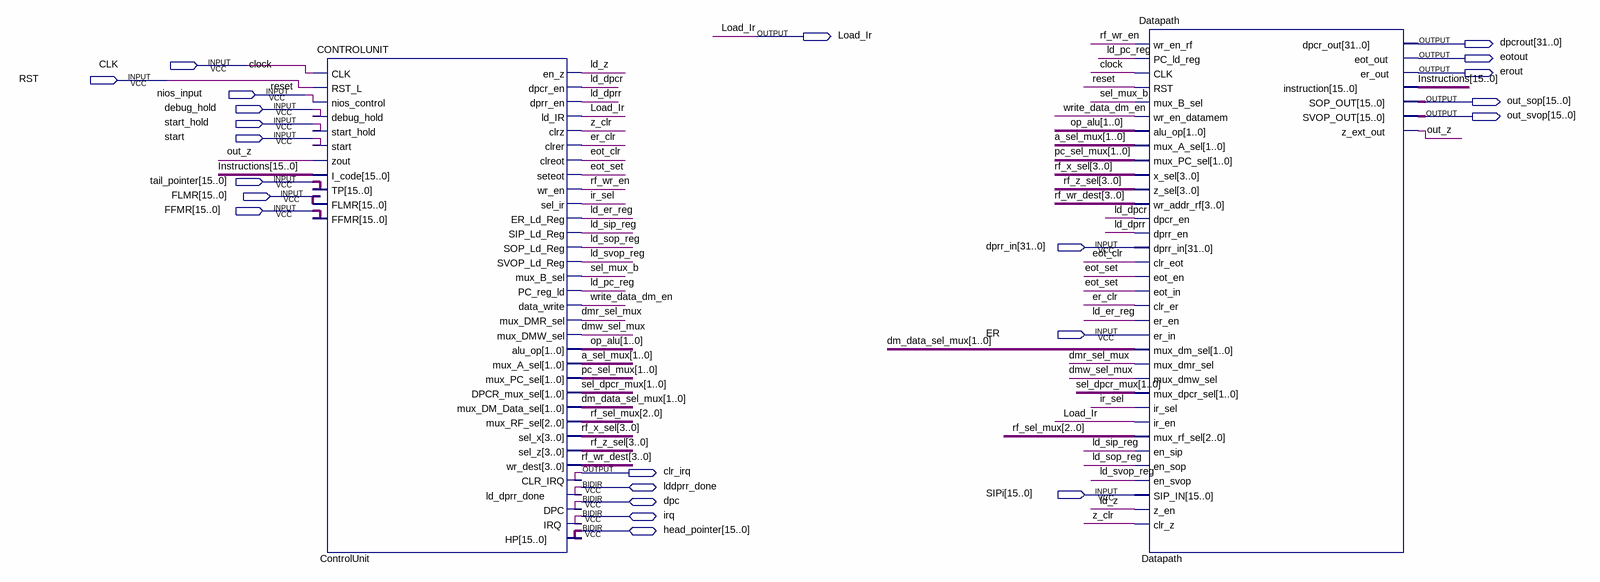
[diagram p0: schematic sheet]
// Quartus schematic Processor.bdf as structural Verilog: 2 symbols, 23 pins
module Processor (
  input  CLK,
  input  RST,
  input  nios_input,
  input  debug_hold,
  input  start_hold,
  input  start,
  input  [15:0] tail_pointer,
  input  [15:0] FLMR,
  input  [15:0] FFMR,
  input  [31:0] dprr_in,
  input  ER,
  input  [15:0] SIPi,
  inout  lddprr_done,
  inout  dpc,
  inout  irq,
  inout  [15:0] head_pointer,
  output Load_Ir,
  output [31:0] dpcrout,
  output eotout,
  output erout,
  output [15:0] out_sop,
  output [15:0] out_svop,
  output clr_irq
);

  wire dmr_sel_mux, dmw_sel_mux, eot_clr, eot_set, er_clr, ir_sel, ld_dpcr, ld_dprr, ld_er_reg, ld_pc_reg,
       ld_sip_reg, ld_sop_reg, ld_svop_reg, ld_z, out_z, rf_wr_en, sel_mux_b, write_data_dm_en, z_clr;
  wire [1:0] a_sel_mux, dm_data_sel_mux, op_alu, pc_sel_mux, sel_dpcr_mux;
  wire [2:0] rf_sel_mux;
  wire [3:0] rf_wr_dest, rf_x_sel, rf_z_sel;
  wire [15:0] Instructions;

  CONTROLUNIT ControlUnit (
    .CLK(CLK), .RST_L(RST), .nios_control(nios_input), .debug_hold(debug_hold), .start_hold(start_hold),
    .start(start), .zout(out_z), .I_code(Instructions), .TP(tail_pointer), .FLMR(FLMR), .FFMR(FFMR),
    .en_z(ld_z), .dpcr_en(ld_dpcr), .dprr_en(ld_dprr), .ld_IR(Load_Ir), .clrz(z_clr), .clrer(er_clr),
    .clreot(eot_clr), .seteot(eot_set), .wr_en(rf_wr_en), .sel_ir(ir_sel), .ER_Ld_Reg(ld_er_reg),
    .SIP_Ld_Reg(ld_sip_reg), .SOP_Ld_Reg(ld_sop_reg), .SVOP_Ld_Reg(ld_svop_reg), .mux_B_sel(sel_mux_b),
    .PC_reg_ld(ld_pc_reg), .data_write(write_data_dm_en), .mux_DMR_sel(dmr_sel_mux),
    .mux_DMW_sel(dmw_sel_mux), .alu_op(op_alu), .mux_A_sel(a_sel_mux), .mux_PC_sel(pc_sel_mux),
    .DPCR_mux_sel(sel_dpcr_mux), .mux_DM_Data_sel(dm_data_sel_mux), .mux_RF_sel(rf_sel_mux),
    .sel_x(rf_x_sel), .sel_z(rf_z_sel), .wr_dest(rf_wr_dest), .CLR_IRQ(clr_irq), .ld_dprr_done(lddprr_done),
    .DPC(dpc), .IRQ(irq), .HP(head_pointer));
  Datapath Datapath (
    .wr_en_rf(rf_wr_en), .PC_ld_reg(ld_pc_reg), .CLK(CLK), .RST(RST), .mux_B_sel(sel_mux_b),
    .wr_en_datamem(write_data_dm_en), .alu_op(op_alu), .mux_A_sel(a_sel_mux), .mux_PC_sel(pc_sel_mux),
    .x_sel(rf_x_sel), .z_sel(rf_z_sel), .wr_addr_rf(rf_wr_dest), .dpcr_en(ld_dpcr), .dprr_en(ld_dprr),
    .dprr_in(dprr_in), .clr_eot(eot_clr), .eot_en(eot_set), .eot_in(eot_set), .clr_er(er_clr),
    .er_en(ld_er_reg), .er_in(ER), .mux_dm_sel(dm_data_sel_mux), .mux_dmr_sel(dmr_sel_mux),
    .mux_dmw_sel(dmw_sel_mux), .mux_dpcr_sel(sel_dpcr_mux), .ir_sel(ir_sel), .ir_en(Load_Ir),
    .mux_rf_sel(rf_sel_mux), .en_sip(ld_sip_reg), .en_sop(ld_sop_reg), .en_svop(ld_svop_reg), .SIP_IN(SIPi),
    .z_en(ld_z), .clr_z(z_clr), .dpcr_out(dpcrout), .eot_out(eotout), .er_out(erout),
    .instruction(Instructions), .SOP_OUT(out_sop), .SVOP_OUT(out_svop), .z_ext_out(out_z));

  // Other names for the same wires on the sheet: clock = CLK; reset = RST
endmodule
